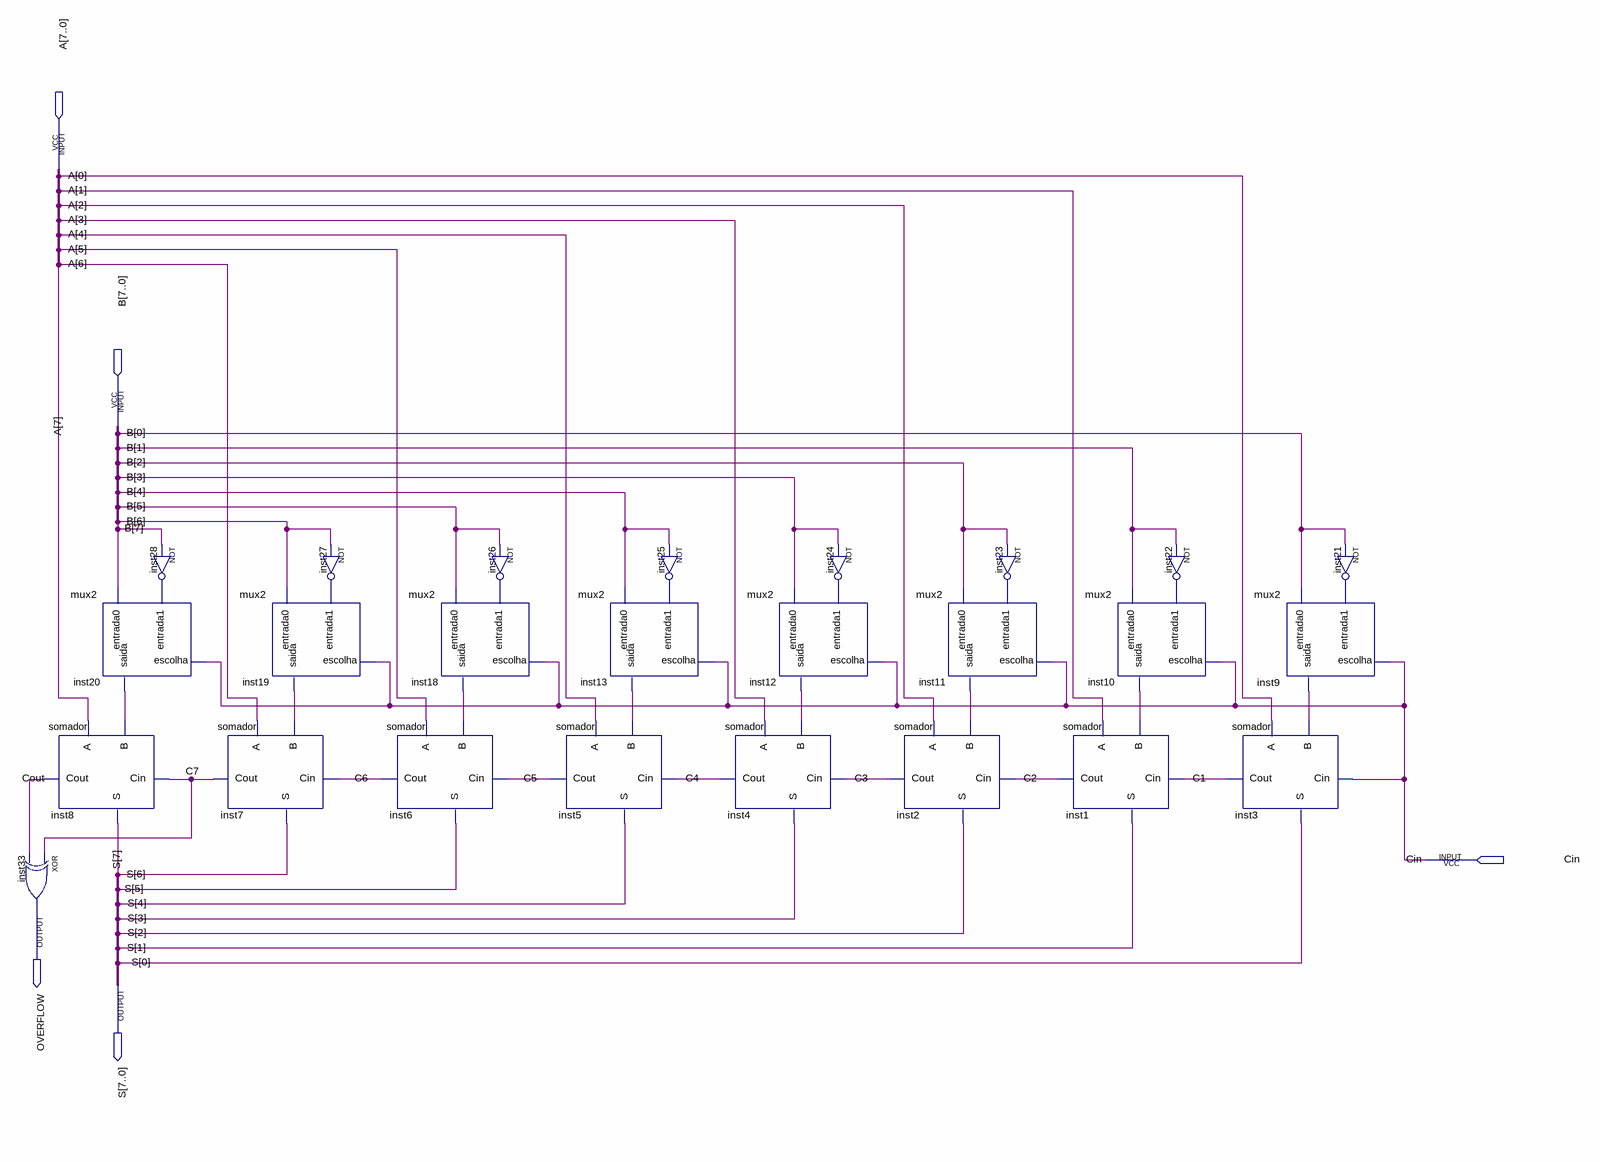
[diagram p0: schematic sheet]
// Quartus schematic somsub.bdf as structural Verilog: 25 symbols, 5 pins
module somsub (
  input  [7:0] A,
  input  [7:0] B,
  input  Cin,
  output OVERFLOW,
  output [7:0] S
);

  wire C1, C2, C3, C4, C5, C6, C7, Cout, inst9_saida, inst10_saida, inst11_saida, inst12_saida, inst13_saida,
       inst18_saida, inst19_saida, inst20_saida, inst21_out, inst22_out, inst23_out, inst24_out, inst25_out,
       inst26_out, inst27_out, inst28_out;

  mux2 inst20 (.entrada0(B[7]), .entrada1(inst28_out), .escolha(Cin), .saida(inst20_saida));
  somador inst8 (.A(A[7]), .B(inst20_saida), .Cin(C7), .S(S[7]), .Cout(Cout));
  xor inst33 (OVERFLOW, C7, Cout);
  not inst28 (inst28_out, B[7]);
  mux2 inst19 (.entrada0(B[6]), .entrada1(inst27_out), .escolha(Cin), .saida(inst19_saida));
  somador inst7 (.A(A[6]), .B(inst19_saida), .Cin(C6), .S(S[6]), .Cout(C7));
  not inst27 (inst27_out, B[6]);
  mux2 inst18 (.entrada0(B[5]), .entrada1(inst26_out), .escolha(Cin), .saida(inst18_saida));
  somador inst6 (.A(A[5]), .B(inst18_saida), .Cin(C5), .S(S[5]), .Cout(C6));
  not inst26 (inst26_out, B[5]);
  mux2 inst13 (.entrada0(B[4]), .entrada1(inst25_out), .escolha(Cin), .saida(inst13_saida));
  somador inst5 (.A(A[4]), .B(inst13_saida), .Cin(C4), .S(S[4]), .Cout(C5));
  not inst25 (inst25_out, B[4]);
  mux2 inst12 (.entrada0(B[3]), .entrada1(inst24_out), .escolha(Cin), .saida(inst12_saida));
  somador inst4 (.A(A[3]), .B(inst12_saida), .Cin(C3), .S(S[3]), .Cout(C4));
  not inst24 (inst24_out, B[3]);
  somador inst2 (.A(A[2]), .B(inst11_saida), .Cin(C2), .S(S[2]), .Cout(C3));
  mux2 inst11 (.entrada0(B[2]), .entrada1(inst23_out), .escolha(Cin), .saida(inst11_saida));
  not inst23 (inst23_out, B[2]);
  somador inst1 (.A(A[1]), .B(inst10_saida), .Cin(C1), .S(S[1]), .Cout(C2));
  mux2 inst10 (.entrada0(B[1]), .entrada1(inst22_out), .escolha(Cin), .saida(inst10_saida));
  not inst22 (inst22_out, B[1]);
  somador inst3 (.A(A[0]), .B(inst9_saida), .Cin(Cin), .S(S[0]), .Cout(C1));
  mux2 inst9 (.entrada0(B[0]), .entrada1(inst21_out), .escolha(Cin), .saida(inst9_saida));
  not inst21 (inst21_out, B[0]);
endmodule
